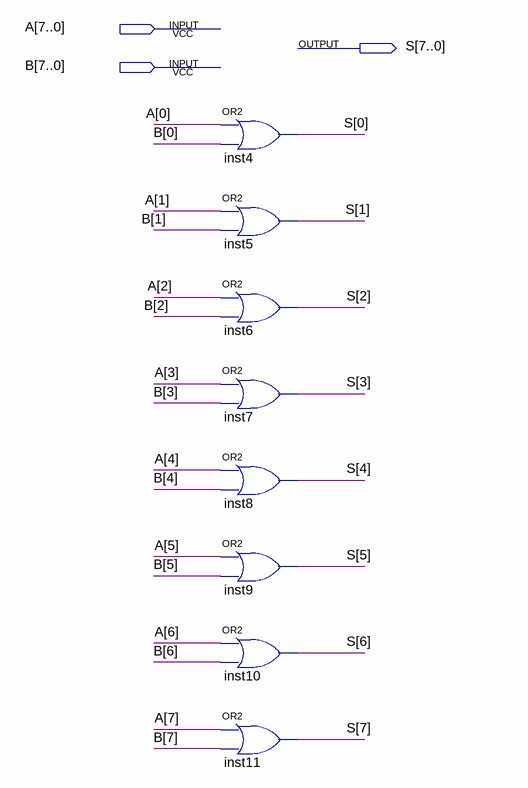
[diagram p0: schematic sheet]
// Quartus schematic OR_8_BITS.bdf as structural Verilog: 8 symbols, 3 pins
module OR_8_BITS (
  input  [7:0] A,
  input  [7:0] B,
  output [7:0] S
);

  or inst4 (S[0], A[0], B[0]);
  or inst5 (S[1], A[1], B[1]);
  or inst6 (S[2], A[2], B[2]);
  or inst7 (S[3], A[3], B[3]);
  or inst8 (S[4], A[4], B[4]);
  or inst9 (S[5], A[5], B[5]);
  or inst10 (S[6], A[6], B[6]);
  or inst11 (S[7], A[7], B[7]);
endmodule
